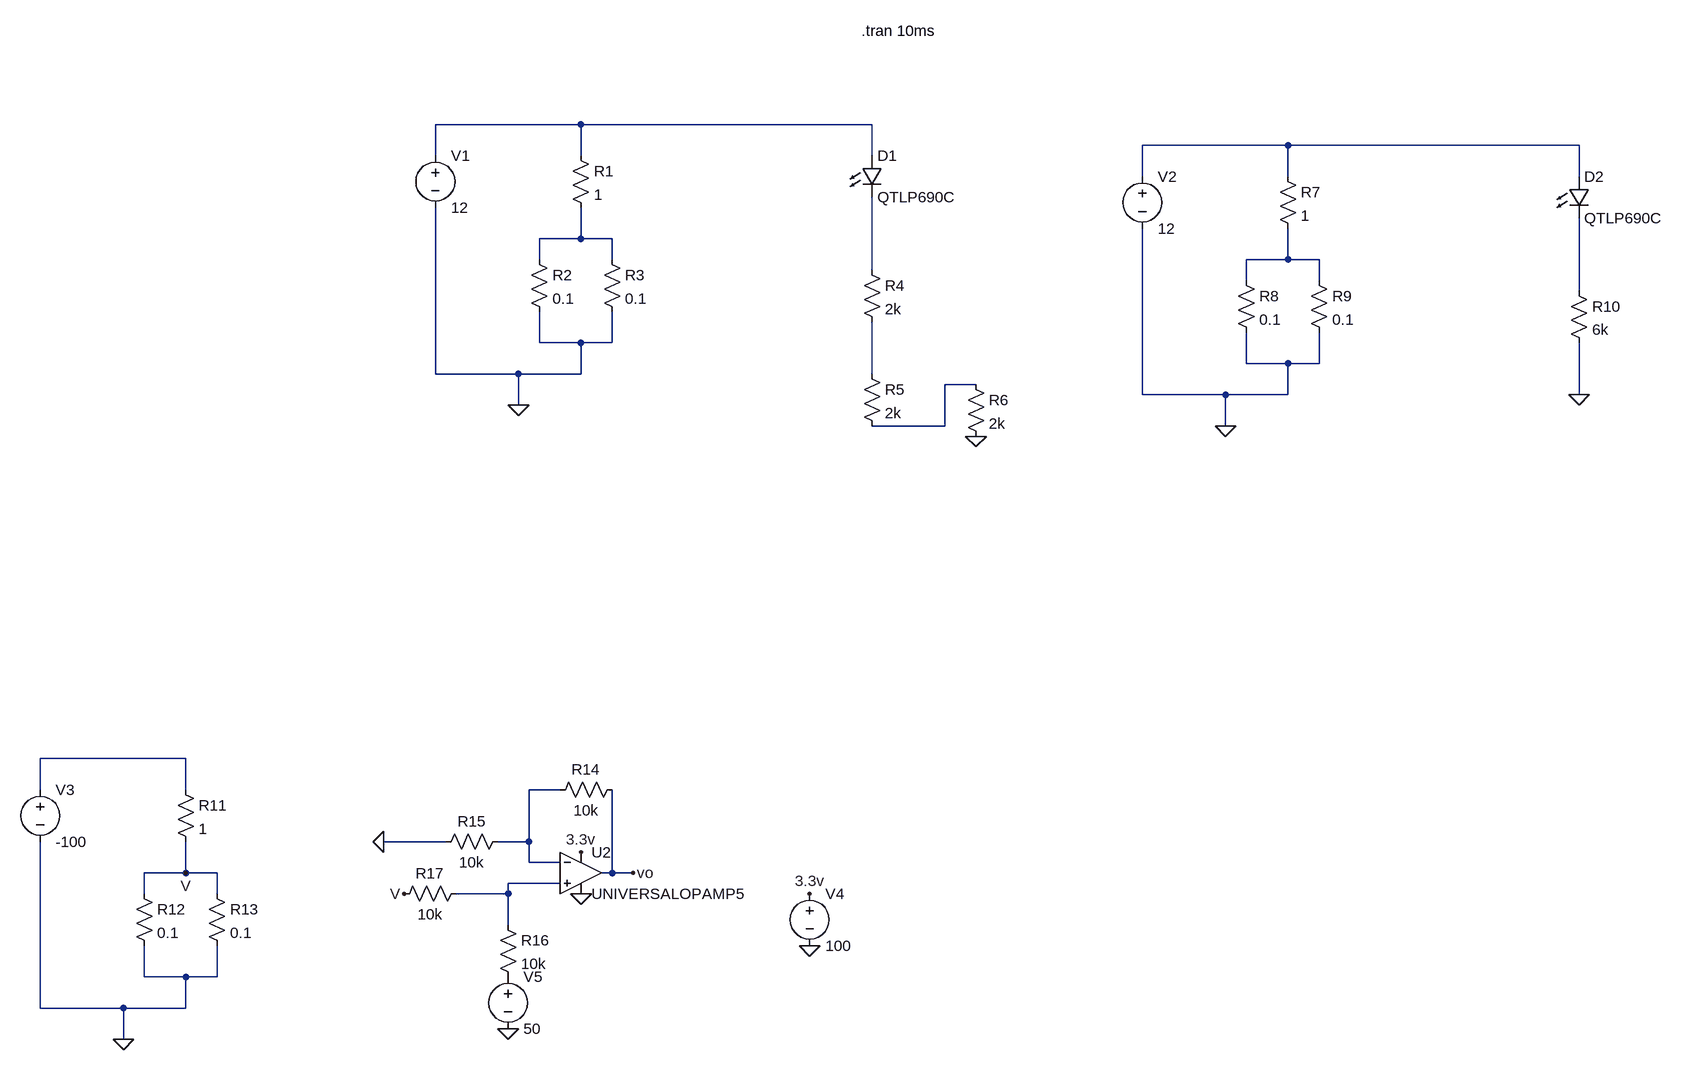
[diagram p0: schematic Draft6.asc]
Draft6.asc, the LTspice schematic file:
Version 4
SHEET 1 2004 1556
WIRE 240 80 16 80
WIRE 688 80 240 80
WIRE 1328 112 1104 112
WIRE 1776 112 1328 112
WIRE 16 128 16 80
WIRE 240 128 240 80
WIRE 688 128 688 80
WIRE 1104 160 1104 112
WIRE 1328 160 1328 112
WIRE 1776 160 1776 112
WIRE 240 256 240 208
WIRE 240 256 176 256
WIRE 288 256 240 256
WIRE 176 288 176 256
WIRE 288 288 288 256
WIRE 1328 288 1328 240
WIRE 1328 288 1264 288
WIRE 1376 288 1328 288
WIRE 688 304 688 192
WIRE 1264 320 1264 288
WIRE 1376 320 1376 288
WIRE 1776 336 1776 224
WIRE 176 416 176 368
WIRE 240 416 176 416
WIRE 288 416 288 368
WIRE 288 416 240 416
WIRE 1264 448 1264 400
WIRE 1328 448 1264 448
WIRE 1376 448 1376 400
WIRE 1376 448 1328 448
WIRE 16 464 16 208
WIRE 144 464 16 464
WIRE 240 464 240 416
WIRE 240 464 144 464
WIRE 688 464 688 384
WIRE 848 480 800 480
WIRE 1104 496 1104 240
WIRE 1232 496 1104 496
WIRE 1328 496 1328 448
WIRE 1328 496 1232 496
WIRE 1776 496 1776 416
WIRE 144 512 144 464
WIRE 800 544 800 480
WIRE 800 544 688 544
WIRE 1232 544 1232 496
WIRE -368 1056 -592 1056
WIRE -592 1104 -592 1056
WIRE -368 1104 -368 1056
WIRE 208 1104 160 1104
WIRE 32 1184 -64 1184
WIRE 160 1184 160 1104
WIRE 160 1184 112 1184
WIRE 160 1216 160 1184
WIRE 208 1216 160 1216
WIRE -368 1232 -368 1184
WIRE -368 1232 -432 1232
WIRE -320 1232 -368 1232
WIRE 288 1232 288 1104
WIRE 288 1232 272 1232
WIRE 320 1232 288 1232
WIRE 208 1248 128 1248
WIRE -432 1264 -432 1232
WIRE -320 1264 -320 1232
WIRE 128 1264 128 1248
WIRE 128 1264 48 1264
WIRE 128 1312 128 1264
WIRE -432 1392 -432 1344
WIRE -368 1392 -432 1392
WIRE -320 1392 -320 1344
WIRE -320 1392 -368 1392
WIRE -592 1440 -592 1184
WIRE -464 1440 -592 1440
WIRE -368 1440 -368 1392
WIRE -368 1440 -464 1440
WIRE -464 1488 -464 1440
FLAG 144 512 0
FLAG 848 560 0
FLAG 1232 544 0
FLAG 1776 496 0
FLAG -464 1488 0
FLAG -368 1232 V
FLAG -64 1184 0
FLAG -32 1264 V
FLAG 240 1264 0
FLAG 592 1344 0
FLAG 592 1264 3.3v
FLAG 240 1200 3.3v
FLAG 320 1232 vo
FLAG 128 1472 0
SYMBOL voltage 16 112 R0
WINDOW 123 0 0 Left 0
WINDOW 39 0 0 Left 0
SYMATTR InstName V1
SYMATTR Value 12
SYMBOL res 224 112 R0
SYMATTR InstName R1
SYMATTR Value 1
SYMBOL res 160 272 R0
SYMATTR InstName R2
SYMATTR Value 0.1
SYMBOL res 272 272 R0
SYMATTR InstName R3
SYMATTR Value 0.1
SYMBOL LED 672 128 R0
SYMATTR InstName D1
SYMATTR Value QTLP690C
SYMATTR Description Diode
SYMATTR Type diode
SYMBOL res 672 288 R0
SYMATTR InstName R4
SYMATTR Value 2k
SYMBOL res 672 448 R0
SYMATTR InstName R5
SYMATTR Value 2k
SYMBOL res 832 464 R0
SYMATTR InstName R6
SYMATTR Value 2k
SYMBOL voltage 1104 144 R0
WINDOW 123 0 0 Left 0
WINDOW 39 0 0 Left 0
SYMATTR InstName V2
SYMATTR Value 12
SYMBOL res 1312 144 R0
SYMATTR InstName R7
SYMATTR Value 1
SYMBOL res 1248 304 R0
SYMATTR InstName R8
SYMATTR Value 0.1
SYMBOL res 1360 304 R0
SYMATTR InstName R9
SYMATTR Value 0.1
SYMBOL LED 1760 160 R0
SYMATTR InstName D2
SYMATTR Value QTLP690C
SYMATTR Description Diode
SYMATTR Type diode
SYMBOL res 1760 320 R0
SYMATTR InstName R10
SYMATTR Value 6k
SYMBOL voltage -592 1088 R0
WINDOW 123 0 0 Left 0
WINDOW 39 0 0 Left 0
SYMATTR InstName V3
SYMATTR Value -100
SYMBOL res -384 1088 R0
SYMATTR InstName R11
SYMATTR Value 1
SYMBOL res -448 1248 R0
SYMATTR InstName R12
SYMATTR Value 0.1
SYMBOL res -336 1248 R0
SYMATTR InstName R13
SYMATTR Value 0.1
SYMBOL res 304 1088 R90
WINDOW 0 0 56 VBottom 2
WINDOW 3 32 56 VTop 2
SYMATTR InstName R14
SYMATTR Value 10k
SYMBOL res 128 1168 R90
WINDOW 0 0 56 VBottom 2
WINDOW 3 32 56 VTop 2
SYMATTR InstName R15
SYMATTR Value 10k
SYMBOL res 112 1296 R0
SYMATTR InstName R16
SYMATTR Value 10k
SYMBOL res 64 1248 R90
WINDOW 0 0 56 VBottom 2
WINDOW 3 32 56 VTop 2
SYMATTR InstName R17
SYMATTR Value 10k
SYMBOL OpAmps\\UniversalOpAmp5 240 1232 R0
SYMATTR InstName U2
SYMBOL voltage 592 1248 R0
WINDOW 123 0 0 Left 0
WINDOW 39 0 0 Left 0
SYMATTR InstName V4
SYMATTR Value 100
SYMBOL voltage 128 1376 R0
WINDOW 123 0 0 Left 0
WINDOW 39 0 0 Left 0
SYMATTR InstName V5
SYMATTR Value 50
TEXT 672 -64 Left 2 !.tran 10ms

The netlist it stands for:
* Draft6.asc
V1 N001 0 12
R1 N001 N003 1
R2 N003 0 0.1
R3 N003 0 0.1
D1 N001 N005 QTLP690C
R4 N005 N007 2k
R5 N007 N008 2k
R6 N008 0 2k
V2 N002 0 12
R7 N002 N004 1
R8 N004 0 0.1
R9 N004 0 0.1
D2 N002 N006 QTLP690C
R10 N006 0 6k
V3 N009 0 -100
R11 N009 V 1
R12 V 0 0.1
R13 V 0 0.1
R14 vo N010 10k
R15 N010 0 10k
R16 N011 P001 10k
R17 N011 V 10k
XU2 N011 N010 3.3v 0 vo level5 Avol=1Meg GBW=10Meg Phimargin=45 SlewPos=10Meg SlewNeg=10Meg En=0 Enk=0 In=0 Ink=0 Rcm=500Meg Ccm=1p Rdiff=500k Cdiff=2p Ro=1k Vos=0 Ibp=2n Ibn=1n Iq=1m Rail=0 Ilimit=25m  ; UNIVERSALOPAMP5, pins In+ In- V+ V- OUT
V4 3.3v 0 100
V5 P001 0 50
.model D D
.lib standard.dio
.tran 10ms
.backanno
.end